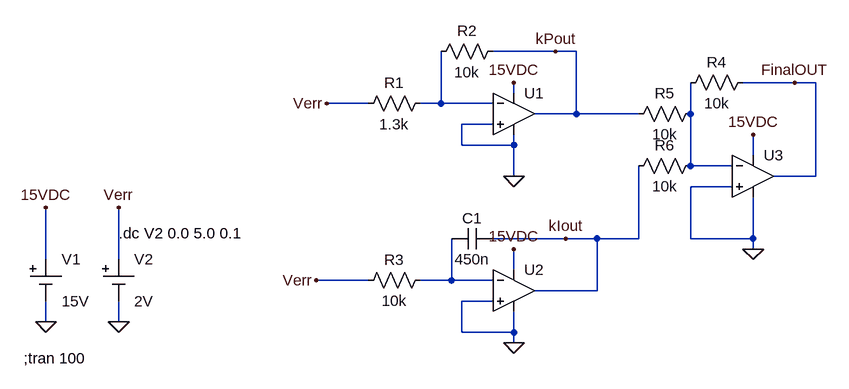
[diagram p0: schematic PID-Cotroller.asc]
PID-Cotroller.asc, the LTspice schematic file:
Version 4
SHEET 1 880 680
WIRE -128 -16 -224 -16
WIRE -96 -16 -128 -16
WIRE 240 32 160 32
WIRE 272 32 240 32
WIRE -192 48 -192 32
WIRE -416 64 -480 64
WIRE -304 64 -304 -16
WIRE -304 64 -336 64
WIRE -224 64 -304 64
WIRE -96 80 -96 -16
WIRE -96 80 -160 80
WIRE 0 80 -96 80
WIRE 80 80 80 32
WIRE -224 96 -272 96
WIRE -272 128 -272 96
WIRE -192 128 -192 112
WIRE -192 128 -272 128
WIRE 176 144 176 112
WIRE 80 160 80 80
WIRE 144 160 80 160
WIRE -192 176 -192 128
WIRE 272 176 272 32
WIRE 272 176 208 176
WIRE 144 192 80 192
WIRE -112 272 -224 272
WIRE -64 272 -112 272
WIRE 0 272 0 160
WIRE 0 272 -64 272
WIRE 80 272 80 192
WIRE 176 272 176 208
WIRE 176 272 80 272
WIRE 176 288 176 272
WIRE -912 304 -912 224
WIRE -800 304 -800 224
WIRE -192 320 -192 288
WIRE -416 336 -496 336
WIRE -288 336 -288 272
WIRE -288 336 -336 336
WIRE -224 336 -288 336
WIRE -64 352 -64 272
WIRE -64 352 -160 352
WIRE -224 368 -272 368
WIRE -912 400 -912 368
WIRE -800 400 -800 368
WIRE -272 416 -272 368
WIRE -192 416 -192 384
WIRE -192 416 -272 416
WIRE -192 432 -192 416
FLAG -192 176 0
FLAG -192 432 0
FLAG -912 400 0
FLAG -912 224 15VDC
FLAG -192 32 15VDC
FLAG -192 288 15VDC
FLAG -128 -16 kPout
FLAG -112 272 kIout
FLAG -800 400 0
FLAG -800 224 Verr
FLAG -480 64 Verr
FLAG -496 336 Verr
FLAG 176 288 0
FLAG 176 112 15VDC
FLAG 240 32 FinalOUT
SYMBOL OpAmps\\UniversalOpAmp -192 80 R0
SYMATTR InstName U1
SYMBOL OpAmps\\UniversalOpAmp -192 352 R0
SYMATTR InstName U2
SYMBOL Misc\\cell -912 304 R0
SYMATTR InstName V1
SYMATTR Value 15V
SYMBOL res -208 -32 R90
WINDOW 0 0 56 VBottom 2
WINDOW 3 32 56 VTop 2
SYMATTR InstName R2
SYMATTR Value 10k
SYMBOL res -320 320 R90
WINDOW 0 0 56 VBottom 2
WINDOW 3 32 56 VTop 2
SYMATTR InstName R3
SYMATTR Value 10k
SYMBOL cap -288 256 M90
WINDOW 0 0 32 VBottom 2
WINDOW 3 32 32 VTop 2
SYMATTR InstName C1
SYMATTR Value 450n
SYMBOL res -320 48 R90
WINDOW 0 0 56 VBottom 2
WINDOW 3 32 56 VTop 2
SYMATTR InstName R1
SYMATTR Value 1.3k
SYMBOL Misc\\cell -800 304 R0
SYMATTR InstName V2
SYMATTR Value 2V
SYMBOL OpAmps\\UniversalOpAmp 176 176 R0
SYMATTR InstName U3
SYMBOL res 96 64 R90
WINDOW 0 0 56 VBottom 2
WINDOW 3 32 56 VTop 2
SYMATTR InstName R5
SYMATTR Value 10k
SYMBOL res 96 144 R90
WINDOW 0 0 56 VBottom 2
WINDOW 3 32 56 VTop 2
SYMATTR InstName R6
SYMATTR Value 10k
SYMBOL res 176 16 R90
WINDOW 0 0 56 VBottom 2
WINDOW 3 32 56 VTop 2
SYMATTR InstName R4
SYMATTR Value 10k
TEXT -946 456 Left 2 !;tran 100
TEXT -800 264 Left 2 !.dc V2 0.0 5.0 0.1

The netlist it stands for:
* PID-Cotroller.asc
XU1 0 N001 15VDC 0 kPout level1 Avol=1Meg GBW=10Meg Vos=0 En=0 Enk=0 In=0 Ink=0 Rin=500Meg  ; pins In+ In- V+ V- OUT
XU2 0 N003 15VDC 0 kIout level1 Avol=1Meg GBW=10Meg Vos=0 En=0 Enk=0 In=0 Ink=0 Rin=500Meg  ; pins In+ In- V+ V- OUT
V1 15VDC 0 15V
R2 kPout N001 10k
R3 N003 Verr 10k
C1 N003 kIout 450n
R1 N001 Verr 1.3k
V2 Verr 0 2V
XU3 0 N002 15VDC 0 FinalOUT level1 Avol=1Meg GBW=10Meg Vos=0 En=0 Enk=0 In=0 Ink=0 Rin=500Meg  ; pins In+ In- V+ V- OUT
R5 N002 kPout 10k
R6 N002 kIout 10k
R4 FinalOUT N002 10k
;tran 100
.dc V2 0.0 5.0 0.1
.lib UniversalOpAmp1.lib
.backanno
.end